# EasyEDA schematic SCH_ZehnderCan-V2_2024-05-12.json
TITLE: Zehnder Can Interface; REV: 1.0; Date: 2024-04-15; Sheet: 1/1; Drawn By: kiwidan
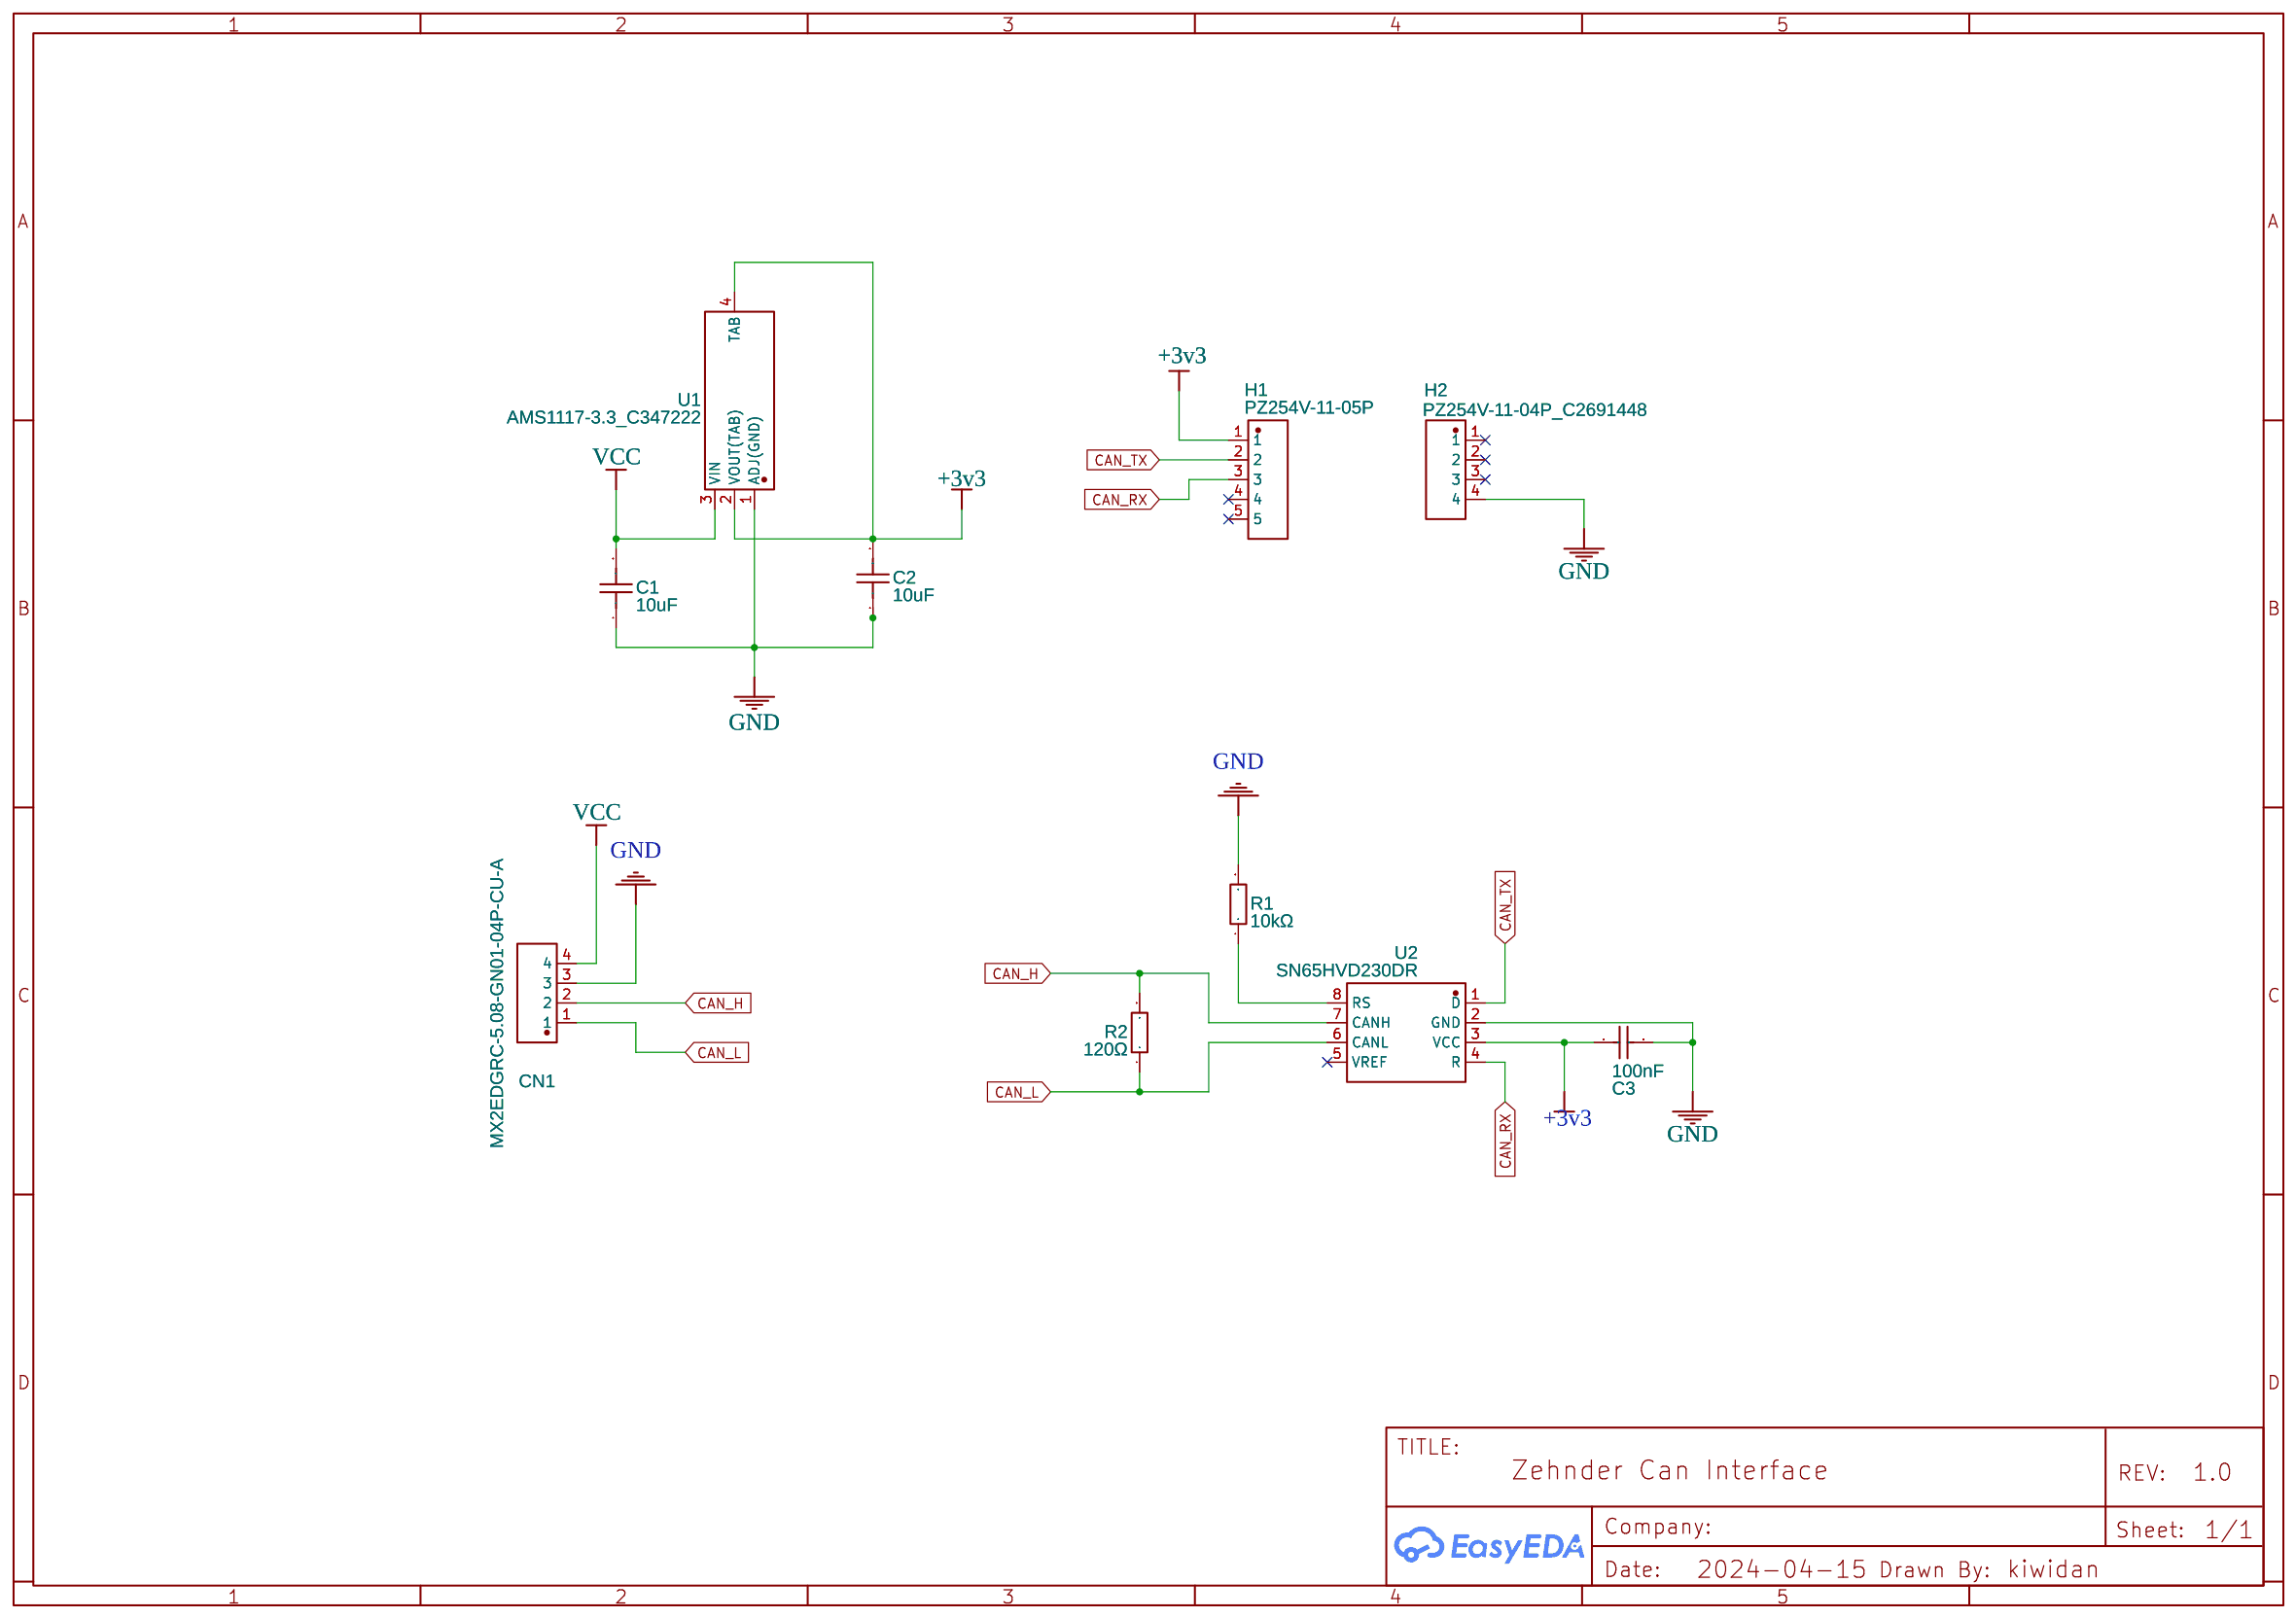
[diagram p0: schematic sheet]

## Parts
C1  10uF  [C0603]
C2  10uF  [C0603]
C3  100nF  [C0603]
CN1  MX2EDGRC-5.08-GN01-04P-CU-A  [CONN-TH_4P-P5.08_MX2EDGRC-5.08-GN01-04P-CU-A]
H1  PZ254V-11-05P  [HDR-TH_5P-P2.54-V-M]
H2  PZ254V-11-04P_C2691448  [HDR-TH_4P-P2.54-V-M]
R1  10kΩ  [R0603]
R2  120Ω  [R0603]
U1  AMS1117-3.3_C347222  [SOT-223-4_L6.5-W3.5-P2.30-LS7.0-BR]
U2  SN65HVD230DR  [SOIC-8_L4.9-W3.9-P1.27-LS6.0-BL]

## Library data of the parts
C1 C2 = CL10A106MA8NRNC: Supplier: LCSC; Manufacturer: SAMSUNG(三星); Supplier Part: C96446; JLCPCB Part Class: Basic Part
C3 = CL10B104KO8NNNC: Supplier: LCSC; Manufacturer: SAMSUNG(三星); Supplier Part: C66501; JLCPCB Part Class: Extended Part
CN1 = MX2EDGRC-5.08-GN01-04P-CU-A: Supplier: LCSC; Supplier Part: C5188021; Manufacturer: MAX(迈旭); Manufacturer Part: MX2EDGRC-5.08-GN01-04P-Cu-A; JLCPCB Part Class: Extended Part; Contributor: lcsc
H1 = PZ254V-11-05P: Contributor: LCSC; Supplier: LCSC; Supplier Part: C492404; Manufacturer: XFCN(兴飞); JLCPCB Part Class: Extended Part
H2 = PZ254V-11-04P_C2691448: Contributor: LCSC; Supplier: LCSC; Supplier Part: C2691448; Manufacturer: XFCN(兴飞); Manufacturer Part: PZ254V-11-04P; JLCPCB Part Class: Extended Part
R1 = 0603WAF1002T5E: Supplier: LCSC; Manufacturer: UNI-ROYAL(厚声); Supplier Part: C25804; JLCPCB Part Class: Basic Part
R2 = 0603WAF1200T5E: Supplier: LCSC; Manufacturer: UNI-ROYAL(厚声); Supplier Part: C22787; JLCPCB Part Class: Basic Part
U1 = AMS1117-3.3_C347222: Contributor: LCSC; Supplier: LCSC; Supplier Part: C347222; Manufacturer: UMW(友台半导体); Manufacturer Part: AMS1117-3.3; JLCPCB Part Class: Extended Part; Package Display: No
U2 = SN65HVD230DR: Supplier: LCSC; Manufacturer: TI(德州仪器); Supplier Part: C12084; JLCPCB Part Class: Extended Part

## Nets
+3v3: C2.2 C3.1 H1.1 U1.2(VOUT(TAB)) U1.4(TAB) U2.3(VCC)
GND: C1.1 C2.1 C3.2 CN1.3 H2.4 R1.2 U1.1(ADJ(GND)) U2.2(GND)
VCC: C1.2 CN1.4 U1.3(VIN)
CAN_H: CN1.2 R2.2 U2.7(CANH)
CAN_L: CN1.1 R2.1 U2.6(CANL)
CAN_RX: H1.3 U2.4(R)
CAN_TX: H1.2 U2.1(D)
Net-(R1-1): R1.1 U2.8(RS)

Not connected (* = marked no-connect by the designer): H1 4* 5*; H2 1* 2* 3*; U2 5(VREF)*
